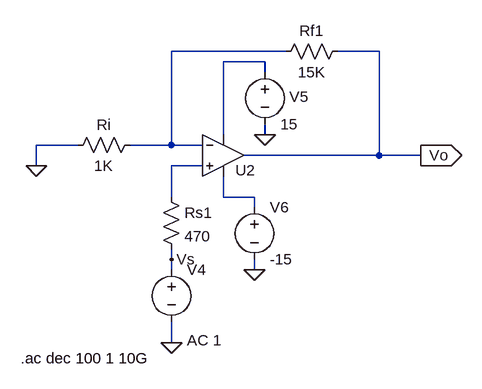
[diagram p0: schematic Run_2_B.asc]
Run_2_B.asc, the LTspice schematic file:
Version 4
SHEET 1 880 680
WIRE -304 -80 -480 -80
WIRE -160 -80 -224 -80
WIRE -336 -64 -400 -64
WIRE -336 -48 -336 -64
WIRE -400 48 -400 -64
WIRE -336 48 -336 32
WIRE -624 64 -688 64
WIRE -480 64 -480 -80
WIRE -480 64 -544 64
WIRE -432 64 -480 64
WIRE -160 80 -160 -80
WIRE -160 80 -368 80
WIRE -96 80 -160 80
WIRE -688 96 -688 64
WIRE -432 96 -480 96
WIRE -480 144 -480 96
WIRE -400 144 -400 112
WIRE -352 144 -400 144
WIRE -352 160 -352 144
WIRE -480 240 -480 224
WIRE -480 256 -480 240
WIRE -352 256 -352 240
WIRE -480 368 -480 336
FLAG -96 80 Vo
IOPIN -96 80 Out
FLAG -480 368 0
FLAG -688 96 0
FLAG -480 240 Vs
FLAG -336 48 0
FLAG -352 256 0
SYMBOL res -528 48 R90
WINDOW 0 0 56 VBottom 2
WINDOW 3 32 56 VTop 2
SYMATTR InstName Ri
SYMATTR Value 1K
SYMBOL OpAmps\\UniversalOpamp2 -400 80 R0
WINDOW 0 19 23 Left 2
SYMATTR InstName U2
SYMBOL res -208 -96 R90
WINDOW 0 0 56 VBottom 2
WINDOW 3 32 56 VTop 2
SYMATTR InstName Rf1
SYMATTR Value 15K
SYMBOL res -496 128 R0
SYMATTR InstName Rs1
SYMATTR Value 470
SYMBOL voltage -480 240 R0
WINDOW 123 24 124 Left 2
WINDOW 39 0 0 Left 0
SYMATTR Value2 AC 1
SYMATTR InstName V4
SYMATTR Value ""
SYMBOL voltage -336 -64 R0
WINDOW 0 38 54 Left 2
WINDOW 123 0 0 Left 0
WINDOW 39 0 0 Left 0
SYMATTR InstName V5
SYMATTR Value 15
SYMBOL voltage -352 144 R0
WINDOW 123 0 0 Left 0
WINDOW 39 0 0 Left 0
SYMATTR InstName V6
SYMATTR Value -15
TEXT -712 392 Left 2 !.ac dec 100 1 10G

The netlist it stands for:
* Run_2_B.asc
Ri N001 0 1K
XU2 N003 N001 N002 N004 Vo level.2 Avol=1Meg GBW=10Meg Slew=10Meg ilimit=25m rail=0 Vos=0 phimargin=45 en=0 enk=0 in=0 ink=0 Rin=500Meg  ; pins IN+ IN- V+ V- OUT
Rf1 Vo N001 15K
Rs1 N003 Vs 470
V4 Vs 0 AC 1
V5 N002 0 15
V6 N004 0 -15
.ac dec 100 1 10G
.lib UniversalOpamps2.sub
.backanno
.end